# Altium project PCB_Project.PrjPcb
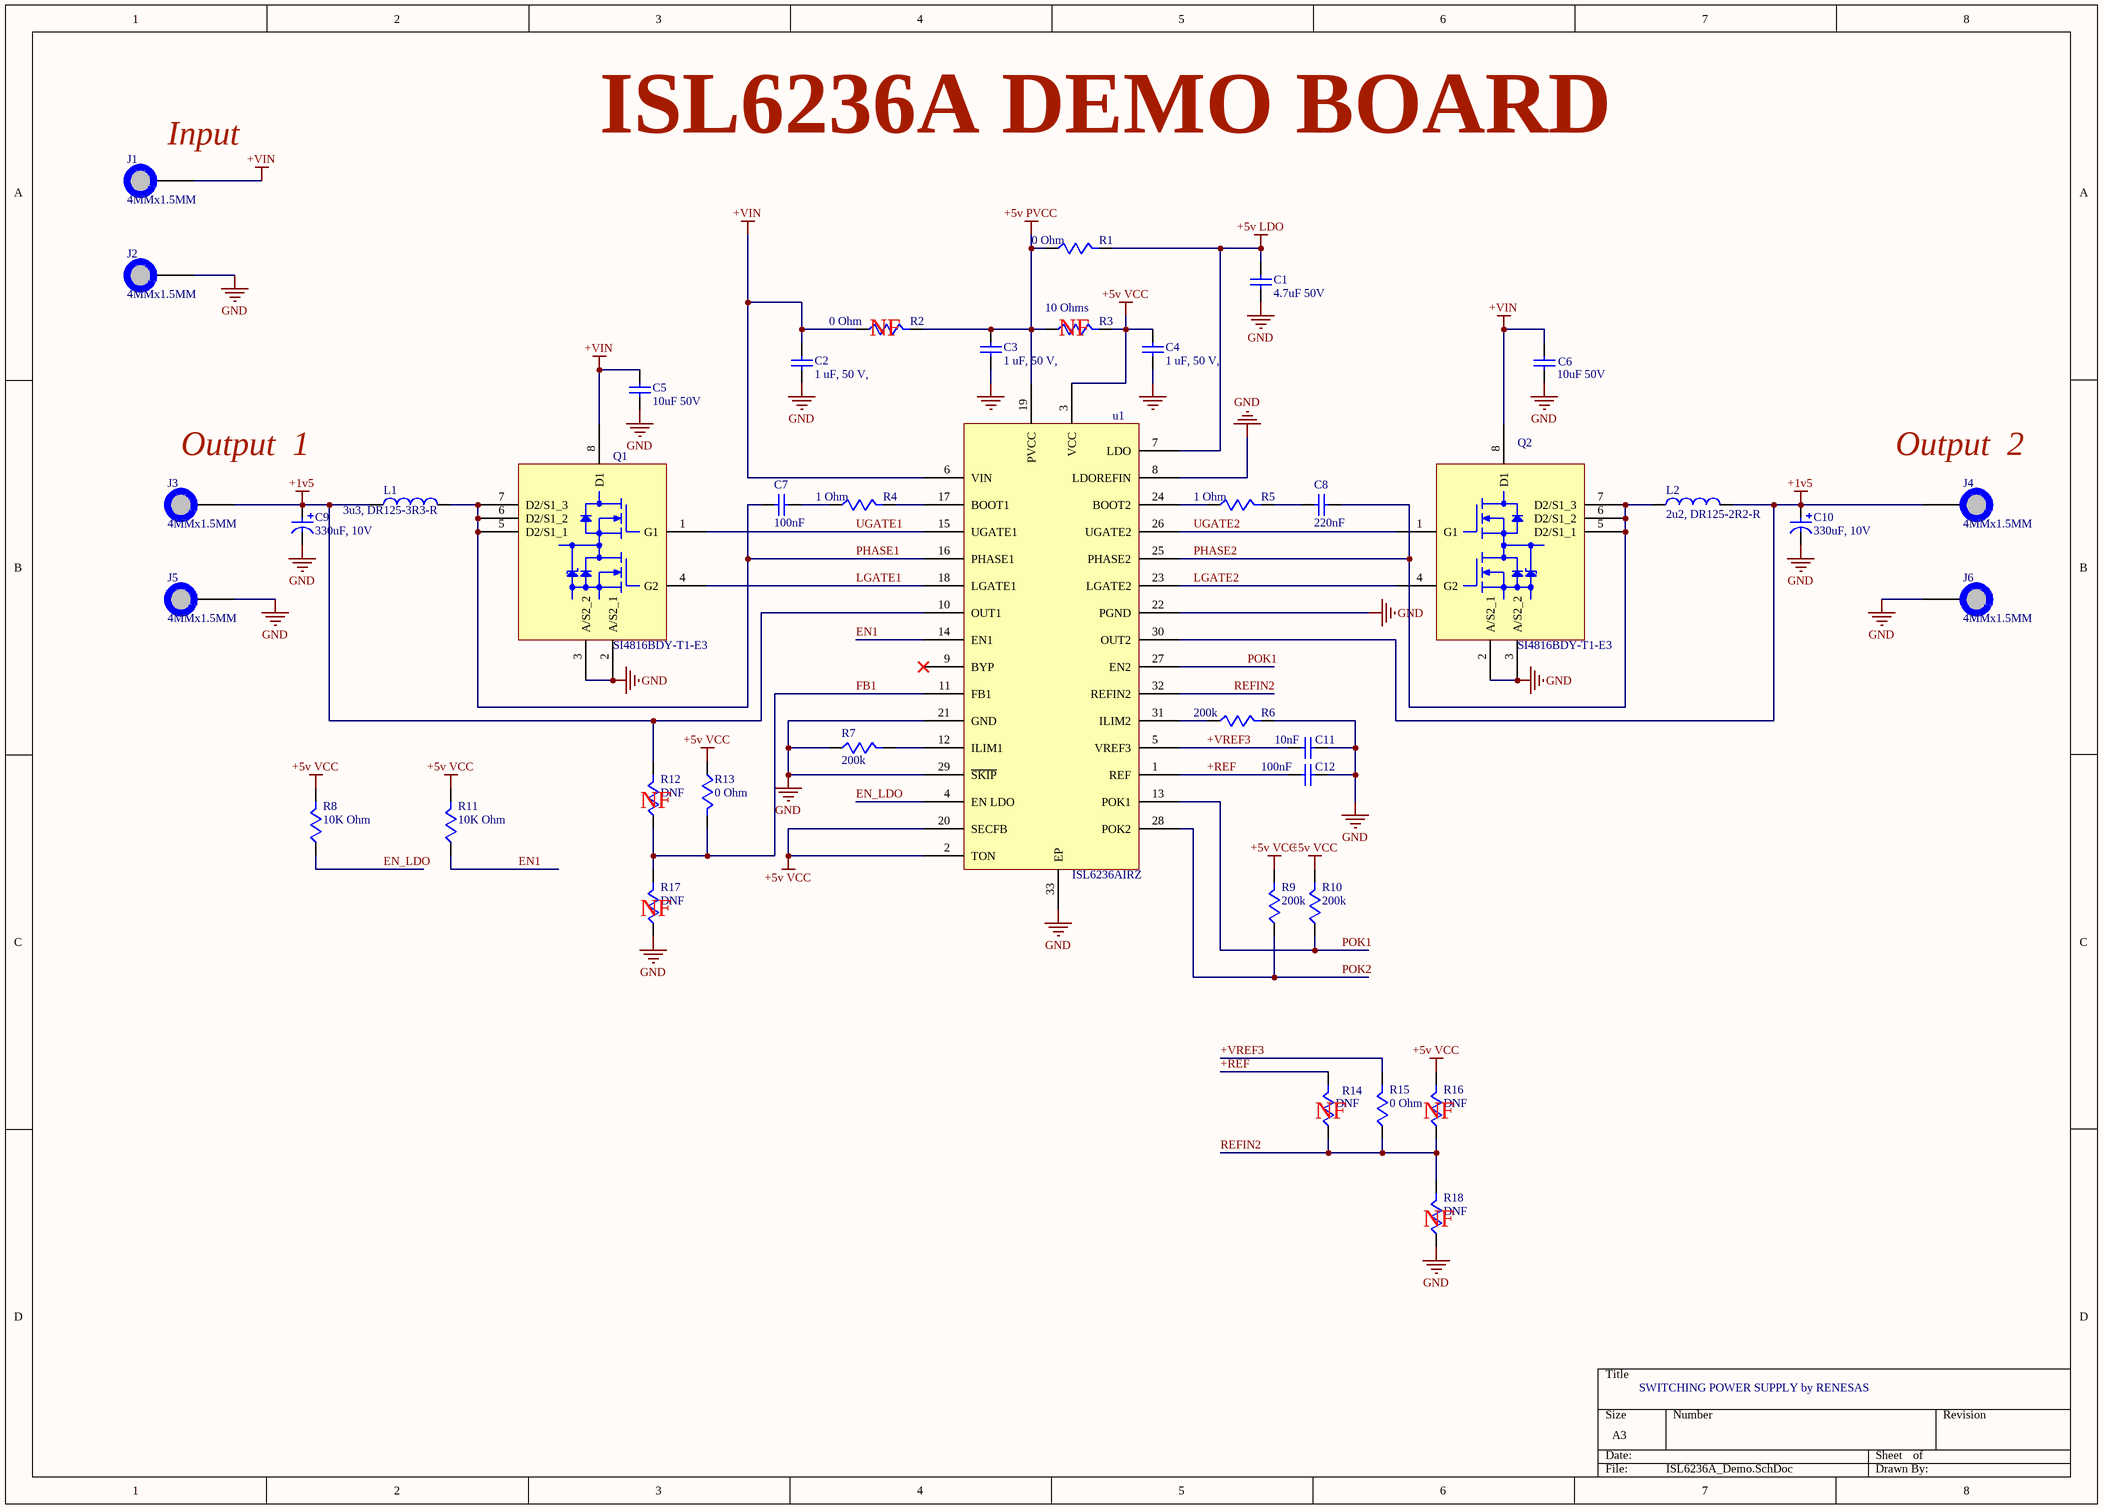
[diagram p0: ISL6236A_Demo.SchDoc]
1 sheet, 41 parts. Net scope: global (net labels, ports and power ports of the same name join across sheets).

## Sheet ISL6236A_Demo.SchDoc
size A3; SheetNumber: 1; SheetTotal: 1

### Parts
C1  4.7uF 50V
C2  1 uF, 50 V,
C3  1 uF, 50 V,
C4  1 uF, 50 V,
C5  10uF 50V
C6  10uF 50V
C7  100nF
C8  220nF
C9  330uF, 10V
C10  330uF, 10V
C11  10nF
C12  100nF
J1  4MMx1.5MM
J2  4MMx1.5MM
J3  4MMx1.5MM
J4  4MMx1.5MM
J5  4MMx1.5MM
J6  4MMx1.5MM
L1  3u3, DR125-3R3-R
L2  2u2, DR125-2R2-R
Q1  SI4816BDY-T1-E3
Q2  SI4816BDY-T1-E3
R1  0 Ohm
R2  0 Ohm
R3  10 Ohms
R4  1 Ohm
R5  1 Ohm
R6  200k
R7  200k
R8  10K Ohm
R9  200k
R10  200k
R11  10K Ohm
R12  DNF
R13  0 Ohm
R14  DNF
R15  0 Ohm
R16  DNF
R17  DNF
R18  DNF
u1  ISL6236AIRZ

### Nets
+1v5: C9.1 C10.1 J3.1 J4.1 L1.1 L2.2 R12.2 u1.10(OUT1) u1.30(OUT2)
+5v LDO: C1.2 R1.2 u1.7(LDO)
+5v PVCC: C3.2 R1.1 R2.2 R3.1 u1.19(PVCC)
+5v VCC: C4.2 R3.2 R8.2 R9.2 R10.2 R11.2 R13.1 R16.2 u1.2(TON) u1.3(VCC) u1.20(SECFB)
+VIN: C2.2 C5.2 C6.2 J1.1 Q1.8(D1) Q2.8(D1) R2.1 u1.6(VIN)
GND: C1.1 C2.1 C3.1 C4.1 C5.1 C6.1 C9.2 C10.2 C11.2 C12.2 J2.1 J5.1 J6.1 Q1.2(A/S2_1) Q1.3(A/S2_2) Q2.2(A/S2_1) Q2.3(A/S2_2) R6.2 R7.1 R17.1 R18.1 u1.8(LDOREFIN) u1.21(GND) u1.22(PGND) u1.29(~{SKIP}) u1.33(EP)
+REF: C12.1 R14.2 u1.1(REF)
+VREF3: C11.1 R15.2 u1.5(VREF3)
EN1: R11.1 u1.14(EN1)
EN_LDO: R8.1 u1.4(EN_LDO)
FB1: R12.1 R13.2 R17.2 u1.11(FB1)
LGATE1: Q1.4(G2) u1.18(LGATE1)
LGATE2: Q2.4(G2) u1.23(LGATE2)
PHASE1: C7.1 L1.2 Q1.5(D2/S1_1) Q1.6(D2/S1_2) Q1.7(D2/S1_3) u1.16(PHASE1)
PHASE2: C8.2 L2.1 Q2.5(D2/S1_1) Q2.6(D2/S1_2) Q2.7(D2/S1_3) u1.25(PHASE2)
POK1: R10.1 u1.13(POK1) u1.27(EN2)
POK2: R9.1 u1.28(POK2)
REFIN2: R14.1 R15.1 R16.1 R18.2 u1.32(REFIN2)
UGATE1: Q1.1(G1) u1.15(UGATE1)
UGATE2: Q2.1(G1) u1.26(UGATE2)
NetC7_2: C7.2 R4.1
NetC8_1: C8.1 R5.2
NetR4_2: R4.2 u1.17(BOOT1)
NetR5_1: R5.1 u1.24(BOOT2)
NetR6_1: R6.1 u1.31(ILIM2)
NetR7_2: R7.2 u1.12(ILIM1)

Not connected (* = marked no-connect by the designer): u1 9(BYP)*

### Notes on the sheet
- (near J1) Input
- ISL6236A DEMO BOARD
- (near R2) NF
- (near R3) NF
- Output  1
- (near J4) Output  2
- (near R12) NF
- (near R17) NF
- (near R14) NF
- (near R16) NF
- (near R18) NF
- SWITCHING POWER SUPPLY by RENESAS

### Library data of the parts
C1 = C3216X5R1H475K160AB: C Series 1206 4.7 uF 50 V ±10 % Tolerance X5R SMT Multilayer Ceramic Capacitor; Manufacturer: TDK; Tolerance: 10%; Supplier: Arrow Electronics; Supplier Part Number: C3216X5R1H475K160AB; Manufacturer Part Number: C3216X5R1H475K160AB; RoHS: Yes; Category: Ceramic Capacitors; Stock: 714; Pricing: 487=0.2054, 500=0.1924 (USD); Mounting Technology: Surface Mount; Case/Package: 1206; Case Code (Imperial): 1206; Case Code (Metric): 3216; Weight: 0.000571oz; Dielectric Material: Ceramic; Min Operating Temperature: -55°C; Max Operating Temperature: 85°C; Value: 4.7uF; Packaging: Tape and Reel; Voltage Rating: 50V; Voltage Rating (DC): 50V; Package Quantity: 2000; Dielectric: X5R; Termination: SMD/SMT; Series: C; Construction: Flat; Length: 3.2mm; Width: 1.6mm; Height: 1.6mm; Depth: 1.6mm; Lead Free: Lead Free; RoHS Compliant: Yes; ComponentLink1URL: https://datasheet.ciiva.com/24216/c3216x5r1h475k160ab-265269-24216325.pdf?src-supplier=Mouser; ComponentLink1Description: https://datasheet.ciiva.com/24216/c3216x5r1h475k160ab-265269-24216325.pdf?src-supplier=Mouser; ComponentLink2URL: https://datasheet.ciiva.com/6286/tdkmlcccaprange-6286230.pdf?src-supplier=Digikey; ComponentLink2Description: https://datasheet.ciiva.com/6286/tdkmlcccaprange-6286230.pdf?src-supplier=Digikey; ComponentLink3URL: https://datasheet.ciiva.com/6286/tdkmlcccaprange-6286233.pdf?src-supplier=Digikey; ComponentLink3Description: https://datasheet.ciiva.com/6286/tdkmlcccaprange-6286233.pdf?src-supplier=Digikey; ComponentLink4URL: https://datasheet.ciiva.com/6286/tdkmlcccaprange-6286236.pdf?src-supplier=Digikey; ComponentLink4Description: https://datasheet.ciiva.com/6286/tdkmlcccaprange-6286236.pdf?src-supplier=Digikey
C2-C4 = C2012X7R1H105K125AB: Multilayer Ceramic Capacitor, 1 uF, 50 V, ± 10%, X7R, 0805 [2012 Metric]; Manufacturer: TDK; Value: 1uF; Voltage Rating: 50V; Supplier: Digikey; Supplier Part Number: 445-7547-1-ND; Manufacturer Part Number: C2012X7R1H105K125AB; RoHS: Yes; Category: Ceramic Capacitors; Stock: 83488; Pricing: 1=0.28, 10=0.183, 50=0.1286, 100=0.1038, 500=0.07712, 1000=0.06749 (USD); Mounting Technology: Surface Mount; Case/Package: 0805; Pins: 2; Case Code (Metric): 2012; Case Code (Imperial): 0805; Dielectric Material: Ceramic; Material: Ceramic; Min Operating Temperature: -55°C; Max Operating Temperature: 125°C; Packaging: Tape and Reel; Tolerance: 10%; Package Quantity: 1; Dielectric: X7R; Series: C; Construction: Flat; Length: 2mm; Width: 0.049inch; Height: 1.25mm; Thickness: 0.057inch; Depth: 1.25mm; Reach SVHC Compliant: No; Lead Free: Lead Free; RoHS Compliant: Yes; ComponentLink1URL: https://datasheet.ciiva.com/6274/tdkmlcccaprange-6274886.pdf?src-supplier=Digikey; ComponentLink1Description: https://datasheet.ciiva.com/6274/tdkmlcccaprange-6274886.pdf?src-supplier=Digikey; ComponentLink2URL: https://datasheet.ciiva.com/6274/tdkmlcccaprange-6274888.pdf?src-supplier=Digikey; ComponentLink2Description: https://datasheet.ciiva.com/6274/tdkmlcccaprange-6274888.pdf?src-supplier=Digikey; ComponentLink3URL: https://datasheet.ciiva.com/6274/tdkmlcccaprange-6274890.pdf?src-supplier=Digikey; ComponentLink3Description: https://datasheet.ciiva.com/6274/tdkmlcccaprange-6274890.pdf?src-supplier=Digikey; ComponentLink4URL: https://datasheet.ciiva.com/22718/1796654-22718037.pdf?src-supplier=Element14; ComponentLink4Description: https://datasheet.ciiva.com/22718/1796654-22718037.pdf?src-supplier=Element14; ComponentLink5URL: https://datasheet.ciiva.com/28673/mlcc-commercial-general-en-28673565.pdf?src-supplier=Element14; ComponentLink5Description: https://datasheet.ciiva.com/28673/mlcc-commercial-general-en-28673565.pdf?src-supplier=Element14; ComponentLink6URL: https://datasheet.ciiva.com/23803/1796654-23803036.pdf?src-supplier=Newark; ComponentLink6Description: https://datasheet.ciiva.com/23803/1796654-23803036.pdf?src-supplier=Newark; ComponentLink7URL: https://datasheet.ciiva.com/24191/general-b11-24191449.pdf?src-supplier=Future+Electronics; ComponentLink7Description: https://datasheet.ciiva.com/24191/general-b11-24191449.pdf?src-supplier=Future+Electronics
C5 C6 = CL32A106KBJNNNE: Multilayer Ceramic Capacitor, 10 uF, 50 V, ± 10%, X5R, 1210 [3225 Metric]; Manufacturer: Samsung; Supplier: Arrow Electronics; Supplier Part Number: CL32A106KBJNNNE; Manufacturer Part Number: CL32A106KBJNNNE; RoHS: Yes; Category: Ceramic Capacitors; Stock: 80351; Pricing: 577=0.1732, 1000=0.1386, 3000=0.1224, 6000=0.1134, 15000=0.1098, 30000=0.1063, 75000=0.1027 (USD); Mounting Technology: Surface Mount; Case/Package: 1210; Case Code (Metric): 3225; Case Code (Imperial): 1210; Min Operating Temperature: -55°C; Max Operating Temperature: 85°C; Value: 10uF; Tolerance: 10%; Packaging: Cut Tape; Voltage Rating: 50V; Voltage Rating (DC): 50V; Series: CL; Lead Free: Lead Free; RoHS Compliant: Yes; ComponentLink1URL: https://datasheet.ciiva.com/25711/cl32a106kbjnnne-25711770.pdf?src-supplier=Digikey; ComponentLink1Description: https://datasheet.ciiva.com/25711/cl32a106kbjnnne-25711770.pdf?src-supplier=Digikey
C7 C12 = CC0805KRX7R9BB104: Multilayer Ceramic Capacitor, 0.1 uF, 50 V, ± 10%, X7R, 0805 [2012 Metric]; Manufacturer: Yageo; Voltage Rating: 50V; Insulation Resistance: 100GR; Supplier: Digikey; Supplier Part Number: 311-1140-1-ND; Manufacturer Part Number: CC0805KRX7R9BB104; RoHS: Yes; Category: Ceramic Capacitors; Stock: 4695891; Pricing: 1=0.1, 10=0.07, 50=0.0418, 100=0.0329, 500=0.02428, 1000=0.0201 (USD); Mounting Technology: Surface Mount; Case/Package: 0805; Pins: 2; Case Code (Metric): 2012; Case Code (Imperial): 0805; Material: Ceramic; Min Operating Temperature: -55°C; Max Operating Temperature: 125°C; Packaging: Tape and Reel; Value: 100nF; Tolerance: 10%; Package Quantity: 4000; Dielectric: X7R; Termination: SMD/SMT; Voltage: 50V; Series: CC; Length: 2mm; Height: 0.85mm; Depth: 1.25mm; Radiation Hardening: No; Reach SVHC Compliant: No; Lead Free: Lead Free; Halogen Free: Halogen Free; RoHS Compliant: Yes; ComponentLink1URL: https://datasheet.ciiva.com/11786/0900766b80d84f1d-11786009.pdf?src-supplier=Rs; ComponentLink1Description: https://datasheet.ciiva.com/11786/0900766b80d84f1d-11786009.pdf?src-supplier=Rs; ComponentLink2URL: https://datasheet.ciiva.com/155/mlccorderingcode-155929.pdf?src-supplier=Digikey; ComponentLink2Description: https://datasheet.ciiva.com/155/mlccorderingcode-155929.pdf?src-supplier=Digikey; ComponentLink3URL: https://datasheet.ciiva.com/155/mlccorderingcode-155930.pdf?src-supplier=Digikey; ComponentLink3Description: https://datasheet.ciiva.com/155/mlccorderingcode-155930.pdf?src-supplier=Digikey; ComponentLink4URL: https://datasheet.ciiva.com/155/mlccorderingcode-155931.pdf?src-supplier=Digikey; ComponentLink4Description: https://datasheet.ciiva.com/155/mlccorderingcode-155931.pdf?src-supplier=Digikey; ComponentLink5URL: https://datasheet.ciiva.com/11464/upy-gphc-x7r-6-3v-to-50v-8-11464757.pdf?src-supplier=Avnet; ComponentLink5Description: https://datasheet.ciiva.com/11464/upy-gphc-x7r-6-3v-to-50v-8-11464757.pdf?src-supplier=Avnet; ComponentLink6URL: https://datasheet.ciiva.com/46393/1734573-46393307.pdf?src-supplier=Element14; ComponentLink6Description: https://datasheet.ciiva.com/46393/1734573-46393307.pdf?src-supplier=Element14; ComponentLink7URL: https://datasheet.ciiva.com/28450/1489800-28450805.pdf?src-supplier=Element14; ComponentLink7Description: https://datasheet.ciiva.com/28450/1489800-28450805.pdf?src-supplier=Element14; ComponentLink8URL: https://datasheet.ciiva.com/29242/445210-da-01-en-kerko-chip-0805-x7r-0-1uf-10proz-50vg-29242074.pdf?src-supplier=Conrad; ComponentLink8Description: https://datasheet.ciiva.com/29242/445210-da-01-en-kerko-chip-0805-x7r-0-1uf-10proz-50vg-29242074.pdf?src-supplier=Conrad
C8 = C0805C224K5RACTU: Multilayer Ceramic Capacitor, 0.22 uF, 50 V, ± 10%, X7R, 0805 [2012 Metric]; Manufacturer: KEMET; Voltage Rating: 50V; Dissipation Factor: 2.5%; Temperature Coefficient: 30ppm/°C; Supplier: Digikey; Supplier Part Number: 399-C0805C224K5RACTUDKR-ND; Manufacturer Part Number: C0805C224K5RACTU; RoHS: Yes; Category: Ceramic Capacitors; Stock: 486457; Pricing: 1=0.16, 10=0.106, 50=0.063, 100=0.0496, 500=0.03666, 1000=0.03035 (USD); Mounting Technology: Surface Mount,PCB; Case/Package: 0805; Case Code (Metric): 2012; Case Code (Imperial): 0805; Dielectric Material: Ceramic; Material: Ceramic; Min Operating Temperature: -55°C; Max Operating Temperature: 125°C; Package Quantity: 4000; Value: 220nF; Tolerance: 10%; Packaging: Tape and Reel; Voltage Rating (DC): 50V; Dielectric: X7R; Termination: SMD/SMT; Voltage: 50V; Series: SMD Comm X7R; Construction: Flat; Length: 2mm; Width: 1.2mm; Height: 1.1mm; Lead Pitch: 0.75mm; Depth: 1.25mm; Radiation Hardening: No; Reach SVHC Compliant: No; RoHS Compliant: Yes; Lead Free: Lead Free; ComponentLink1URL: https://datasheet.ciiva.com/7842/kem-c1002-x7r-smd-7842582.pdf?src-supplier=Element14; ComponentLink1Description: https://datasheet.ciiva.com/7842/kem-c1002-x7r-smd-7842582.pdf?src-supplier=Element14; ComponentLink2URL: https://datasheet.ciiva.com/28682/1851736-28682316.pdf?src-supplier=Element14; ComponentLink2Description: https://datasheet.ciiva.com/28682/1851736-28682316.pdf?src-supplier=Element14; ComponentLink3URL: https://datasheet.ciiva.com/18193/getdatasheetpartid-304413-18193686.pdf?src-supplier=Verical; ComponentLink3Description: https://datasheet.ciiva.com/18193/getdatasheetpartid-304413-18193686.pdf?src-supplier=Verical
C9 C10 = T530X337M010ATE004: Cap Tant Solid 330uF 10V X CASE 20% (7.3 X 4.3 X 4mm) SMD 7343-43 0.004 Ohm 125 C T/R; Manufacturer: KEMET; Ripple Current: 8.2A; ESR (Equivalent Series Resistance): 4mR; Leakage Current: 330uA; Polarity: Polar; Dissipation Factor: 8%; Supplier: Digikey; Supplier Part Number: 399-10378-1-ND; Manufacturer Part Number: T530X337M010ATE004; RoHS: Yes; Category: Polymer Capacitors; Stock: 865; Pricing: 1=7.14, 10=6.191, 50=5.5562, 100=4.8259 (USD); Mounting Technology: Surface Mount,PCB; Case/Package: 2917; Case Code (Imperial): 2917; Case Code (Metric): 7343; Min Operating Temperature: -55°C; Max Operating Temperature: 125°C; Package Quantity: 500; Voltage Rating (DC): 10V; Value: 330uF; Tolerance: 20%; Packaging: Tape and Reel; Voltage Rating: 10V; Termination: SMD/SMT; Voltage: 10V; Features: General Purpose; Series: T530; Construction: Flat; Length: 7.3mm; Width: 4.3mm; Height: 4mm; Depth: 4.3mm; Reach SVHC Compliant: No; RoHS Compliant: Yes; ComponentLink1URL: https://datasheet.ciiva.com/11794/0900766b80deaa91-11794477.pdf?src-supplier=Rs; ComponentLink1Description: https://datasheet.ciiva.com/11794/0900766b80deaa91-11794477.pdf?src-supplier=Rs; ComponentLink2URL: https://datasheet.ciiva.com/14593/70096008-14593753.pdf?src-supplier=Allied+Electronics; ComponentLink2Description: https://datasheet.ciiva.com/14593/70096008-14593753.pdf?src-supplier=Allied+Electronics
C11 = C0805C103K5RACTU: Multilayer Ceramic Capacitor, 0.01 uF, 50 V, ± 10%, X7R, 0805 [2012 Metric]; Manufacturer: KEMET; Voltage Rating: 50V; Temperature Coefficient: 30ppm/°C; Supplier: Digikey; Supplier Part Number: 399-C0805C103K5RACTUTR-ND; Manufacturer Part Number: C0805C103K5RACTU; RoHS: Yes; Category: Ceramic Capacitors; Stock: 1358518; Pricing: 4000=0.01737, 8000=0.01616, 12000=0.01535, 28000=0.01454, 100000=0.01101, 200000=0.01075, 400000=0.0101 (USD); Mounting Technology: Surface Mount; Case/Package: 0805; Pins: 2NUMBER; Case Code (Imperial): 0805; Case Code (Metric): 2012; Material: Ceramic; Dielectric Material: Ceramic; Min Operating Temperature: -55°C; Max Operating Temperature: 125°C; Value: 10nF; Tolerance: 10%; Packaging: Tape and Reel; Dielectric: X7R; Voltage: 50V; Construction: Flat; Series: SMD Comm X7R; Voltage Rating (AC): 50V; Length: 2mm; Height: 0.78mm; Depth: 1.25mm; Thickness: 889um; Radiation Hardening: No; Reach SVHC Compliant: No; Lead Free: Lead Free; ComponentLink1URL: http://www.onlinecomponents.com/productFiles/mf-KEM/kem_c1002_x7r_smd.pdf?src-supplier=Onlinecomponents.com; ComponentLink1Description: http://www.onlinecomponents.com/productFiles/mf-KEM/kem_c1002_x7r_smd.pdf?src-supplier=Onlinecomponents.com; ComponentLink2URL: http://www.farnell.com/datasheets/2740682.pdf?src-supplier=Farnell; ComponentLink2Description: http://www.farnell.com/datasheets/2740682.pdf?src-supplier=Farnell; ComponentLink3URL: https://www.verical.com/server-webapp/html/getDatasheet?partID=293414&src-supplier=Verical; ComponentLink3Description: https://www.verical.com/server-webapp/html/getDatasheet?partID=293414&src-supplier=Verical; ComponentLink4URL: https://api.kemet.com/component-edge/download/datasheet/C0805C103K5RACTU.pdf?src-supplier=Digikey; ComponentLink4Description: https://api.kemet.com/component-edge/download/datasheet/C0805C103K5RACTU.pdf?src-supplier=Digikey; ComponentLink5URL: https://datasheet.octopart.com/C0805C103K5RACTU-Kemet-datasheet-24570007.pdf?src-supplier=Element14; ComponentLink5Description: https://datasheet.octopart.com/C0805C103K5RACTU-Kemet-datasheet-24570007.pdf?src-supplier=Element14; ComponentLink6URL: http://www.farnell.com/datasheets/2740682.pdf?src-supplier=Element14; ComponentLink6Description: http://www.farnell.com/datasheets/2740682.pdf?src-supplier=Element14; ComponentLink7URL: http://www.farnell.com/datasheets/2740682.pdf?src-supplier=Newark; ComponentLink7Description: http://www.farnell.com/datasheets/2740682.pdf?src-supplier=Newark; ComponentLink8URL: http://www.kemet.com/Lists/ProductCatalog/Attachments/53/KEM_C1002_X7R_SMD.pdf?src-supplier=Avnet; ComponentLink8Description: http://www.kemet.com/Lists/ProductCatalog/Attachments/53/KEM_C1002_X7R_SMD.pdf?src-supplier=Avnet; ComponentLink9URL: https://datasheet.octopart.com/C0805C103K5RAC7800-KEMET-datasheet-37550250.pdf?src-supplier=Electro+Sonic; ComponentLink9Description: https://datasheet.octopart.com/C0805C103K5RAC7800-KEMET-datasheet-37550250.pdf?src-supplier=Electro+Sonic; ComponentLink10URL: https://datasheet.octopart.com/C0805C103K5RACTU-KEMET-datasheet-164512540.pdf?src-supplier=TME; ComponentLink10Description: https://datasheet.octopart.com/C0805C103K5RACTU-KEMET-datasheet-164512540.pdf?src-supplier=TME
J1-J6 = PAD_WITH_HOLE_4MMx1MM: Pad with a hole 4mm x 1.5 mm
L1 = DR125-3R3-R: Inductor Power Shielded Drum Core 3.3uH 20% 100KHz Ferrite 9.26A 6.3mOhm DCR T/R; Manufacturer: Eaton Cooper; Saturation Current: 12.7A; DC Resistance (DCR): 6.3mR; Supplier: Digikey; Supplier Part Number: 513-1529-1-ND; Manufacturer Part Number: DR125-3R3-R; RoHS: Yes; Category: Fixed Inductors; Stock: 24147; Pricing: 1=0.81, 10=0.683, 25=0.6212, 50=0.584, 100=0.4845, 250=0.44728 (USD); Mounting Technology: Surface Mount; Case/Package: Nonstandard; Pins: 2; Core Material: Ferrite; Weight: 0.144oz; Min Operating Temperature: -40°C; Max Operating Temperature: 125°C; Current Rating: 9.26A; Tolerance: 20%; Shielding: Shielded; Packaging: Tape and Reel; Inductance Tolerance: 20%; Package Quantity: 600; Value: 3.3uH; Test Frequency: 100kHz; Max DC Current: 9.26A; Termination: SMD/SMT; RMS Current (Irms): 9.26A; Series: DR; Max Current Rating: 9.26A; Length: 12.5mm; Width: 0.492inch; Height: 6mm; Height - Seated (Max): 0.236inch; Depth: 12.5mm; Radiation Hardening: No; Reach SVHC Compliant: No; Military Standard: Not; Lead Free: Lead Free; ComponentLink1URL: https://datasheet.ciiva.com/26858/getdatasheetpartid-251124-26858392.pdf?src-supplier=Verical; ComponentLink1Description: https://datasheet.ciiva.com/26858/getdatasheetpartid-251124-26858392.pdf?src-supplier=Verical; ComponentLink2URL: https://datasheet.ciiva.com/5707/87246-5707962.pdf?src-supplier=Farnell; ComponentLink2Description: https://datasheet.ciiva.com/5707/87246-5707962.pdf?src-supplier=Farnell; ComponentLink3URL: https://datasheet.ciiva.com/16295/bus-elx-ds-4315-dr-series-16295562.pdf?src-supplier=Future+Electronics; ComponentLink3Description: https://datasheet.ciiva.com/16295/bus-elx-ds-4315-dr-series-16295562.pdf?src-supplier=Future+Electronics; ComponentLink4URL: https://datasheet.ciiva.com/30081/4a32919a-7470-4ae0-be45-b59e3a1351ef-30081146.pdf?src-supplier=Onlinecomponents.com; ComponentLink4Description: https://datasheet.ciiva.com/30081/4a32919a-7470-4ae0-be45-b59e3a1351ef-30081146.pdf?src-supplier=Onlinecomponents.com
L2 = DR125-2R2-R: Ind Power Shielded Wirewound 2.2uH 20% 100KHz Ferrite 10.9A T/R; Manufacturer: Eaton Cooper; Saturation Current: 15A; DC Resistance (DCR): 4.5mR; Supplier: Digikey; Supplier Part Number: 513-1662-1-ND; Manufacturer Part Number: DR125-2R2-R; RoHS: Yes; Category: Fixed Inductors; Stock: 2128; Pricing: 1=1.21, 10=1.02, 25=0.9276, 50=0.8718, 100=0.7234, 250=0.6678 (USD); Mounting Technology: Surface Mount; Case/Package: Nonstandard; Pins: 2; Core Material: Ferrite; Weight: 0.144oz; Min Operating Temperature: -40°C; Max Operating Temperature: 125°C; Package Quantity: 600; Current Rating: 10.9A; Tolerance: 20%; Shielding: Shielded; Packaging: Tape and Reel; Value: 2.2uH; Inductance Tolerance: 20%; Test Frequency: 100kHz; Max DC Current: 10.9A; Termination: SMD/SMT; Self Resonant Frequency: 100kHz; DC Current: 10.9A; RMS Current (Irms): 10.9A; Series: DR; Max Current Rating: 10.9A; Length: 12.5mm; Width: 0.492inch; Height: 6mm; Height - Seated (Max): 0.236inch; Depth: 12.5mm; Radiation Hardening: No; Reach SVHC Compliant: No; Military Standard: Not; Lead Free: Lead Free; RoHS Compliant: Yes; ComponentLink1URL: https://datasheet.ciiva.com/14667/0900766b8116a153-14667792.pdf?src-supplier=Rs; ComponentLink1Description: https://datasheet.ciiva.com/14667/0900766b8116a153-14667792.pdf?src-supplier=Rs; ComponentLink2URL: https://datasheet.ciiva.com/26926/getdatasheetpartid-571249-26926912.pdf?src-supplier=Verical; ComponentLink2Description: https://datasheet.ciiva.com/26926/getdatasheetpartid-571249-26926912.pdf?src-supplier=Verical; ComponentLink3URL: https://datasheet.ciiva.com/8004/87246-8004874.pdf?src-supplier=Element14; ComponentLink3Description: https://datasheet.ciiva.com/8004/87246-8004874.pdf?src-supplier=Element14
Q1 Q2 = SI4816BDY-T1-E3: Transistor MOSFET Array Dual N-CH 30V 5.8A/8.2A 8-Pin SOIC T/R; Manufacturer: Vishay Siliconix; Nominal Vgs: 3V; Rise Time: 9ns; Rds On Max: 18.5mR; Number of Elements: 2; Continuous Drain Current (ID): 8.2A; Drain to Source Resistance: 11.5mR; Gate to Source Voltage (Vgs): 20V; Max Power Dissipation: 1.25W; Turn-Off Delay Time: 31ns; Turn-On Delay Time: 13ns; Threshold Voltage: 1V; FET Type: 2 N-Channel; Polarity: N-CHANNEL; Supplier: Digikey; Supplier Part Number: SI4816BDY-T1-E3CT-ND; Manufacturer Part Number: SI4816BDY-T1-E3; RoHS: Yes; Category: MOSFETs; Stock: 4824; Pricing: 1=1.58, 10=1.311, 100=1.0438, 500=0.88324, 1000=0.74942 (USD); Mounting Technology: Surface Mount; Case/Package: SO; Pins: 8; Weight: 0.006596oz; Min Operating Temperature: -55°C; Max Operating Temperature: 150°C; Packaging: Tape and Reel; Package Quantity: 2500; Drain to Source Voltage (Vdss): 30V; Fall Time: 9ns; Number of Channels: 2; Series: LITTLE FOOT®; Drain-source On Resistance-Max: 18.5mR; Length: 5mm; Width: 4mm; Height: 1.55mm; Radiation Hardening: No; Lead Free: Lead Free; RoHS Compliant: Yes; Reach SVHC Compliant: Unknown; ComponentLink1URL: https://datasheet.ciiva.com/7710/si4816bd-7710449.pdf?src-supplier=Element14; ComponentLink1Description: https://datasheet.ciiva.com/7710/si4816bd-7710449.pdf?src-supplier=Element14; ComponentLink2URL: https://datasheet.ciiva.com/15137/getdatasheetpartid-99188-15137841.pdf?src-supplier=Verical; ComponentLink2Description: https://datasheet.ciiva.com/15137/getdatasheetpartid-99188-15137841.pdf?src-supplier=Verical; ComponentLink3URL: https://datasheet.ciiva.com/928/si4816bd-928458.pdf?src-supplier=Digikey; ComponentLink3Description: https://datasheet.ciiva.com/928/si4816bd-928458.pdf?src-supplier=Digikey; ComponentLink4URL: https://datasheet.ciiva.com/928/si4816bd-928459.pdf?src-supplier=Digikey; ComponentLink4Description: https://datasheet.ciiva.com/928/si4816bd-928459.pdf?src-supplier=Digikey; ComponentLink5URL: https://datasheet.ciiva.com/928/si4816bd-928460.pdf?src-supplier=Digikey; ComponentLink5Description: https://datasheet.ciiva.com/928/si4816bd-928460.pdf?src-supplier=Digikey; ComponentLink6URL: https://datasheet.ciiva.com/11161/si4816bd-11161496.pdf?src-supplier=Avnet; ComponentLink6Description: https://datasheet.ciiva.com/11161/si4816bd-11161496.pdf?src-supplier=Avnet; ComponentLink7URL: https://datasheet.ciiva.com/16486/si4816bd-16486349.pdf?src-supplier=Future+Electronics; ComponentLink7Description: https://datasheet.ciiva.com/16486/si4816bd-16486349.pdf?src-supplier=Future+Electronics; ComponentLink8URL: https://datasheet.ciiva.com/18448/70026226-18448822.pdf?src-supplier=Allied+Electronics; ComponentLink8Description: https://datasheet.ciiva.com/18448/70026226-18448822.pdf?src-supplier=Allied+Electronics
R1 R2 R13 R15 = AC0805JR-070RL: Zero Ohm Resistor, 0805 [2012 Metric], Thick Film, 125 mW, 2 A, Surface Mount; Manufacturer: Yageo; Power Rating: 125mW; Tolerance: 5%; Voltage Rating: 150V; Value: 0R; Temperature Coefficient: 200ppm/°C; Supplier: Digikey; Supplier Part Number: YAG3755CT-ND; Manufacturer Part Number: AC0805JR-070RL; RoHS: Yes; Category: Chip SMD Resistors; Stock: 196311; Pricing: 1=0.1, 10=0.035, 25=0.0272, 50=0.0206, 100=0.0144, 250=0.0116, 500=0.00928, 1000=0.00683 (USD); Case/Package: 0805; Case Code (Imperial): 0805; Case Code (Metric): 2012; Min Operating Temperature: -55°C; Max Operating Temperature: 155°C; Packaging: Tape and Reel; Termination: SMD/SMT; Number of Terminations: 2; Max Power Dissipation: 125mW; Features: Moisture Resistant,Automotive AEC-Q200; Series: AC; Length: 0.079inch; Width: 1.25mm; Height: 0.024inch; Lead Free: Lead Free; RoHS Compliant: Yes; ComponentLink1URL: http://www.yageo.com/NewPortal/yageodocoutput?fileName=/pdf/R-Chip/PYu-AC_51_RoHS_L_6.pdf&src-supplier=Digikey; ComponentLink1Description: http://www.yageo.com/NewPortal/yageodocoutput?fileName=/pdf/R-Chip/PYu-AC_51_RoHS_L_6.pdf&src-supplier=Digikey; ComponentLink2URL: https://datasheet.octopart.com/AC0805JR-070RL-Yageo-datasheet-151884373.pdf?src-supplier=Future+Electronics; ComponentLink2Description: https://datasheet.octopart.com/AC0805JR-070RL-Yageo-datasheet-151884373.pdf?src-supplier=Future+Electronics; ComponentLink3URL: http://www.yageo.com/documents/recent/PYu-AC_51_RoHS_L_2.pdf?src-supplier=Mouser; ComponentLink3Description: http://www.yageo.com/documents/recent/PYu-AC_51_RoHS_L_2.pdf?src-supplier=Mouser
R3 = AC0805FR-0710RL: SMD Chip Resistor, 10 Ohm, ± 1%, 125 mW, 0805 [2012 Metric], Thick Film, General Purpose; Manufacturer: Yageo; Power Rating: 125mW; Value: 10R; Voltage Rating: 150V; Temperature Coefficient: 200ppm/°C; Supplier: Digikey; Supplier Part Number: YAG3690DKR-ND; Manufacturer Part Number: AC0805FR-0710RL; RoHS: Yes; Category: Chip SMD Resistors; Stock: 167567; Pricing: 1=0.11, 10=0.052, 50=0.0338, 100=0.0286, 500=0.02014, 1000=0.01754 (USD); Case/Package: 0805; Case Code (Imperial): 0805; Case Code (Metric): 2012; Min Operating Temperature: -55°C; Max Operating Temperature: 155°C; Packaging: Tape and Reel; Tolerance: 1%; Termination: SMD/SMT; Number of Terminations: 2; Max Power Dissipation: 125mW; Features: Moisture Resistant,Automotive AEC-Q200; Series: AC; Length: 0.079inch; Width: 1.25mm; Height: 0.024inch; Lead Free: Lead Free; RoHS Compliant: Yes; ComponentLink1URL: http://www.mouser.com/ds/2/447/yageodocoutput-1111992.pdf?src-supplier=Mouser; ComponentLink1Description: http://www.mouser.com/ds/2/447/yageodocoutput-1111992.pdf?src-supplier=Mouser; ComponentLink2URL: http://www.yageo.com/NewPortal/yageodocoutput?fileName=/pdf/R-Chip/PYu-AC_51_RoHS_L_6.pdf&src-supplier=Digikey; ComponentLink2Description: http://www.yageo.com/NewPortal/yageodocoutput?fileName=/pdf/R-Chip/PYu-AC_51_RoHS_L_6.pdf&src-supplier=Digikey; ComponentLink3URL: https://www.yageo.com/upload/media/product/productsearch/datasheet/rchip/PYu-AC_51_RoHS_L_7.pdf?src-supplier=Digikey; ComponentLink3Description: https://www.yageo.com/upload/media/product/productsearch/datasheet/rchip/PYu-AC_51_RoHS_L_7.pdf?src-supplier=Digikey; ComponentLink4URL: http://www.yageo.com/documents/recent/PYu-AC_51_RoHS_L_2_revised.pdf?src-supplier=Future+Electronics; ComponentLink4Description: http://www.yageo.com/documents/recent/PYu-AC_51_RoHS_L_2_revised.pdf?src-supplier=Future+Electronics; ComponentLink5URL: https://datasheet.octopart.com/AC0805FR-0710RL-Yageo-datasheet-166720450.pdf?src-supplier=Future+Electronics; ComponentLink5Description: https://datasheet.octopart.com/AC0805FR-0710RL-Yageo-datasheet-166720450.pdf?src-supplier=Future+Electronics; ComponentLink6URL: https://datasheet.octopart.com/AC0805FR-0710RL-Yageo-datasheet-159083007.pdf?src-supplier=TME; ComponentLink6Description: https://datasheet.octopart.com/AC0805FR-0710RL-Yageo-datasheet-159083007.pdf?src-supplier=TME
R4 R5 = AC0805FR-071RL: SMD Chip Resistor, 1 Ohm, ± 1%, 125 mW, 0805 [2012 Metric], Thick Film, General Purpose; Manufacturer: Yageo; Supplier: Digikey; Supplier Part Number: YAG3705CT-ND; Manufacturer Part Number: AC0805FR-071RL; Category: Chip SMD Resistors; Stock: 71458; Pricing: 1=0.1, 10=0.036, 50=0.0238, 100=0.0201, 500=0.01416, 1000=0.01233 (USD); Lead Free: 5697LeadFree; ComponentLink1URL: https://datasheet.ciiva.com/12576/pyu-ac-51-rohs-l-2-12576553.pdf?src-supplier=Mouser; ComponentLink1Description: https://datasheet.ciiva.com/12576/pyu-ac-51-rohs-l-2-12576553.pdf?src-supplier=Mouser; ComponentLink2URL: https://datasheet.octopart.com/AC0805FR-071RL-Yageo-datasheet-12512238.pdf; ComponentLink2Description: https://datasheet.octopart.com/AC0805FR-071RL-Yageo-datasheet-12512238.pdf; ComponentLink3URL: https://datasheet.octopart.com/AC0805FR-071RL-Yageo-datasheet-166720450.pdf?src-supplier=Future+Electronics; ComponentLink3Description: https://datasheet.octopart.com/AC0805FR-071RL-Yageo-datasheet-166720450.pdf?src-supplier=Future+Electronics; ComponentLink4URL: https://datasheet.octopart.com/AC0805FR-071RL-Yageo-datasheet-151884373.pdf?src-supplier=Future+Electronics; ComponentLink4Description: https://datasheet.octopart.com/AC0805FR-071RL-Yageo-datasheet-151884373.pdf?src-supplier=Future+Electronics; ComponentLink5URL: https://datasheet.octopart.com/AC0805FR-071RL-Yageo-datasheet-137699919.pdf?src-supplier=Future+Electronics; ComponentLink5Description: https://datasheet.octopart.com/AC0805FR-071RL-Yageo-datasheet-137699919.pdf?src-supplier=Future+Electronics; ComponentLink6URL: https://datasheet.octopart.com/AC0805FR-071RL-Yageo-datasheet-24580492.pdf?src-supplier=Future+Electronics; ComponentLink6Description: https://datasheet.octopart.com/AC0805FR-071RL-Yageo-datasheet-24580492.pdf?src-supplier=Future+Electronics; ComponentLink7URL: https://datasheet.octopart.com/AC0805FR-071RL-Yageo-datasheet-13029202.pdf?src-supplier=Future+Electronics; ComponentLink7Description: https://datasheet.octopart.com/AC0805FR-071RL-Yageo-datasheet-13029202.pdf?src-supplier=Future+Electronics
R6 R7 R9 R10 = AC0805FR-07200KL: SMD Chip Resistor, 200 kOhm, ± 1%, 125 mW, 0805 [2012 Metric], Thick Film, General Purpose; Manufacturer: Yageo; Power Rating: 125mW; Value: 200kR; Voltage Rating: 150V; Temperature Coefficient: 100ppm/°C; Supplier: Avnet; Supplier Part Number: 49AK0752; Manufacturer Part Number: AC0805FR-07200KL; RoHS: Yes; Category: Chip SMD Resistors; Stock: 3488; Pricing: 1=0.104, 25=0.021, 50=0.017, 100=0.012 (USD); Case Code (Imperial): 0805; Case Code (Metric): 2012; Weight: 0.000194oz; Min Operating Temperature: -55°C; Max Operating Temperature: 155°C; Tolerance: 1%; Packaging: Cut Tape; Termination: SMD/SMT; Series: AC; Technology: THICK FILM; Package Quantity: 5000; Length: 2mm; Width: 1.25mm; Height: 0.5mm; Lead Free: Lead Free; RoHS Compliant: Yes; ComponentLink1URL: http://www.mouser.com/ds/2/447/yageodocoutput-1111992.pdf?src-supplier=Mouser; ComponentLink1Description: http://www.mouser.com/ds/2/447/yageodocoutput-1111992.pdf?src-supplier=Mouser; ComponentLink2URL: http://www.yageo.com/NewPortal/yageodocoutput?fileName=/pdf/R-Chip/PYu-AC_51_RoHS_L_6.pdf&src-supplier=Digikey; ComponentLink2Description: http://www.yageo.com/NewPortal/yageodocoutput?fileName=/pdf/R-Chip/PYu-AC_51_RoHS_L_6.pdf&src-supplier=Digikey; ComponentLink3URL: http://www.yageo.com/documents/recent/PYu-AC_51_RoHS_L_2.pdf?src-supplier=Future+Electronics; ComponentLink3Description: http://www.yageo.com/documents/recent/PYu-AC_51_RoHS_L_2.pdf?src-supplier=Future+Electronics; ComponentLink4URL: https://datasheet.octopart.com/AC0805FR-07200KL-Yageo-datasheet-166720450.pdf?src-supplier=Future+Electronics; ComponentLink4Description: https://datasheet.octopart.com/AC0805FR-07200KL-Yageo-datasheet-166720450.pdf?src-supplier=Future+Electronics; ComponentLink5URL: https://datasheet.octopart.com/AC0805FR-07200KL-Yageo-datasheet-140571090.pdf?src-supplier=Arrow.cn; ComponentLink5Description: https://datasheet.octopart.com/AC0805FR-07200KL-Yageo-datasheet-140571090.pdf?src-supplier=Arrow.cn
R8 R11 = RC0805FR-0710KL: SMD Chip Resistor, 10 kOhm, ± 1%, 125 mW, 0805 [2012 Metric], Thick Film, General Purpose; Manufacturer: Yageo; Value: 10kR; Power Rating: 125mW; Temperature Coefficient: 100ppm/°C; Voltage Rating: 150V; Supplier: Future Electronics; Supplier Part Number: 3310877; Manufacturer Part Number: RC0805FR-0710KL; RoHS: Yes; Category: Chip SMD Resistors; Stock: 7825000; Pricing: 5000=0.004, 25000=0.0038, 100000=0.0036, 250000=0.0034, 625000=0.0032 (USD); Case/Package: 0805; Case Code (Imperial): 0805; Case Code (Metric): 2012; Min Operating Temperature: -55°C; Max Operating Temperature: 155°C; Packaging: Tape and Reel; Tolerance: 1%; Package Quantity: 1; Termination: SMD/SMT; Resistor Type: Thick Film; Number of Terminations: 2; Max Power Dissipation: 125mW; Features: Moisture Resistant; Series: RC; Construction: Rectangular; Resistance Tolerance: 1%; Voltage Rating (AC): 150V; Technology: THICK FILM; Length: 0.079inch; Width: 0.049inch; Height: 0.024inch; Depth: 1.25mm; Lead Free: Lead Free; Reach SVHC Compliant: Unknown; Military Standard: Not; RoHS Compliant: Yes
R12 R14 R16-R18 = RES
u1 = ISL6236AIRZ: ISL6236A Series 25 V Dual Step-Down Switch-Mode Power-Supply Controller - QFN-32; Manufacturer: Renesas; Package Body Material: Plastic; Number of Outputs: 4; Switching Frequency: 500kHz; Output Current: 20A; Throw Configuration: DUAL SWITCHING CONTROLLER; Control Mode: CURRENT-MODE; Control Technique: PULSE WIDTH MODULATION; Max Supply Voltage: 25V; Min Input Voltage: 5.5V; Nominal Supply Voltage: 12V; Channels: 1; Nominal Output Voltage: 1.05V; Switcher Configuration: BUCK; Time @ Peak Reflow Temperature-Max (s): 30s; Supplier: Digikey; Manufacturer Part Number: ISL6236AIRZ; RoHS: Yes; Category: Integrated Circuits (ICs); Stock: 2220; Pricing: 1=6.37, 10=5.754, 25=5.4868, 80=4.76413, 230=4.55004, 490=4.14857, 980=3.61328, 2450=3.47945 (USD); Mounting Technology: Surface Mount; Case/Package: QFN; Pins: 32; Weight: 0.002469oz; Package Shape: Square; Terminal Finish: Tin; Min Operating Temperature: -40°C; Max Operating Temperature: 100°C; Packaging: Rail/Tube; Series: -; Package Quantity: 60; JESD-609 Code: e3; JESD-30 Code: S-PQCC-N32; Moisture Sensitivity Level: 3; Package Style: CHIP CARRIER, HEAT SINK/SLUG, VERY THIN PROFILEMeter; Peak Reflow Temperature (Cel): 260°C; Surface Mount: Yes; Frequency: 500kHz; Technology: BICMOS; Terminal Form: No Lead; Terminal Position: QUAD; Output Voltage: 5.5V; Length: 5mm; Width: 5mm; Height: 0.95mm; Height - Seated (Max): 1mm; Terminal Pitch: 0.5mm; RoHS Compliant: Yes; Reach SVHC Compliant: Yes; Temperature Grade: INDUSTRIAL; ComponentLink1URL: http://www.intersil.com/content/dam/Intersil/documents/isl6/isl6236a.pdf?src-supplier=Digikey; ComponentLink1Description: http://www.intersil.com/content/dam/Intersil/documents/isl6/isl6236a.pdf?src-supplier=Digikey; ComponentLink2URL: https://datasheet.octopart.com/ISL6236AIRZ-Renesas-datasheet-138160199.pdf?src-supplier=Future+Electronics; ComponentLink2Description: https://datasheet.octopart.com/ISL6236AIRZ-Renesas-datasheet-138160199.pdf?src-supplier=Future+Electronics; Supplier Part Number: ISL6236AIRZ-ND